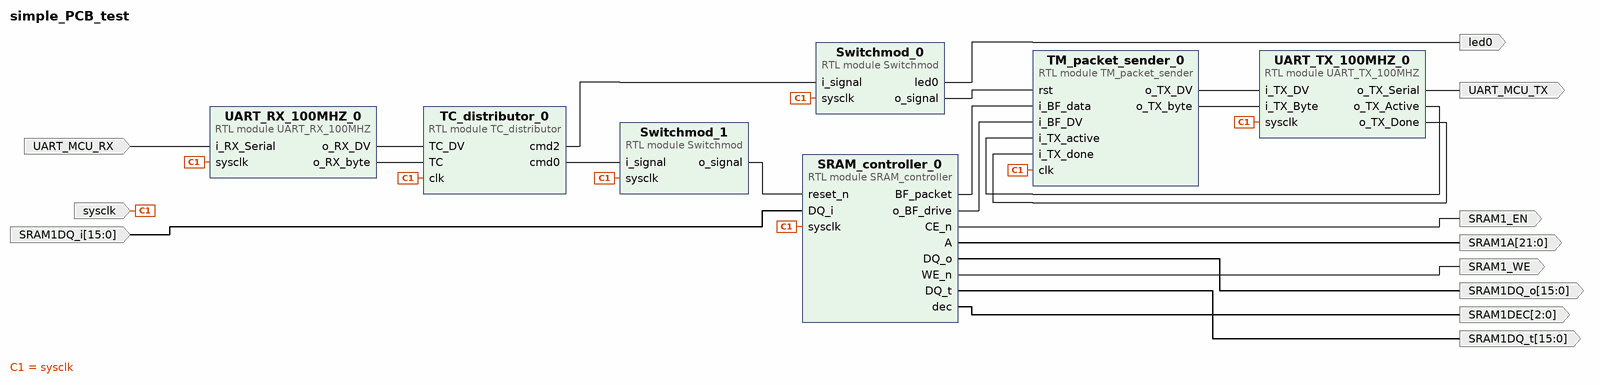
[diagram p0: block diagram of the top level]
# Vivado block design simple_PCB_test, xc7a100tcsg324-1, Vivado 2024.2
create_bd_design simple_PCB_test

create_bd_port -dir I sysclk
create_bd_port -dir O UART_MCU_TX
create_bd_port -dir I -from 15 -to 0 SRAM1DQ_i
create_bd_port -dir O -from 21 -to 0 SRAM1A
create_bd_port -dir O -from 15 -to 0 SRAM1DQ_o
create_bd_port -dir O -from 15 -to 0 SRAM1DQ_t
create_bd_port -dir O -from 2 -to 0 SRAM1DEC
create_bd_port -dir O SRAM1_EN
create_bd_port -dir O SRAM1_WE
create_bd_port -dir I UART_MCU_RX
create_bd_port -dir O led0

create_bd_cell -type module -reference SRAM_controller SRAM_controller_0
create_bd_cell -type module -reference Switchmod Switchmod_0
create_bd_cell -type module -reference TC_distributor TC_distributor_0
create_bd_cell -type module -reference TM_packet_sender TM_packet_sender_0
create_bd_cell -type module -reference UART_TX_100MHZ UART_TX_100MHZ_0
create_bd_cell -type module -reference UART_RX_100MHZ UART_RX_100MHZ_0
create_bd_cell -type module -reference Switchmod Switchmod_1

# ---- connections ----

connect_bd_net -net DQ_i_0_1 [get_bd_ports SRAM1DQ_i] [get_bd_pins SRAM_controller_0/DQ_i]
connect_bd_net [get_bd_pins SRAM_controller_0/A] [get_bd_ports SRAM1A]
connect_bd_net [get_bd_pins SRAM_controller_0/BF_packet] [get_bd_pins TM_packet_sender_0/i_BF_data]
connect_bd_net [get_bd_pins SRAM_controller_0/CE_n] [get_bd_ports SRAM1_EN]
connect_bd_net [get_bd_pins SRAM_controller_0/DQ_o] [get_bd_ports SRAM1DQ_o]
connect_bd_net [get_bd_pins SRAM_controller_0/DQ_t] [get_bd_ports SRAM1DQ_t]
connect_bd_net [get_bd_pins SRAM_controller_0/WE_n] [get_bd_ports SRAM1_WE]
connect_bd_net [get_bd_pins SRAM_controller_0/dec] [get_bd_ports SRAM1DEC]
connect_bd_net [get_bd_pins SRAM_controller_0/o_BF_drive] [get_bd_pins TM_packet_sender_0/i_BF_DV]
connect_bd_net [get_bd_pins Switchmod_0/led0] [get_bd_ports led0]
connect_bd_net [get_bd_pins Switchmod_0/o_signal] [get_bd_pins TM_packet_sender_0/rst]
connect_bd_net [get_bd_pins Switchmod_1/o_signal] [get_bd_pins SRAM_controller_0/reset_n]
connect_bd_net [get_bd_pins TC_distributor_0/cmd0] [get_bd_pins Switchmod_1/i_signal]
connect_bd_net [get_bd_pins TC_distributor_0/cmd2] [get_bd_pins Switchmod_0/i_signal]
connect_bd_net [get_bd_pins TM_packet_sender_0/o_TX_DV] [get_bd_pins UART_TX_100MHZ_0/i_TX_DV]
connect_bd_net [get_bd_pins TM_packet_sender_0/o_TX_byte] [get_bd_pins UART_TX_100MHZ_0/i_TX_Byte]
connect_bd_net [get_bd_pins UART_RX_100MHZ_0/o_RX_DV] [get_bd_pins TC_distributor_0/TC_DV]
connect_bd_net [get_bd_pins UART_RX_100MHZ_0/o_RX_byte] [get_bd_pins TC_distributor_0/TC]
connect_bd_net [get_bd_pins UART_TX_100MHZ_0/o_TX_Active] [get_bd_pins TM_packet_sender_0/i_TX_active]
connect_bd_net [get_bd_pins UART_TX_100MHZ_0/o_TX_Done] [get_bd_pins TM_packet_sender_0/i_TX_done]
connect_bd_net [get_bd_pins UART_TX_100MHZ_0/o_TX_Serial] [get_bd_ports UART_MCU_TX]
connect_bd_net -net i_RX_Serial_0_1 [get_bd_ports UART_MCU_RX] [get_bd_pins UART_RX_100MHZ_0/i_RX_Serial]
connect_bd_net -net sysclk_0_1 [get_bd_ports sysclk] \
  [get_bd_pins Switchmod_0/sysclk] [get_bd_pins TC_distributor_0/clk] [get_bd_pins UART_TX_100MHZ_0/sysclk] \
  [get_bd_pins TM_packet_sender_0/clk] [get_bd_pins UART_RX_100MHZ_0/sysclk] [get_bd_pins Switchmod_1/sysclk] \
  [get_bd_pins SRAM_controller_0/sysclk]

validate_bd_design
save_bd_design
